# Altium schematic sheet ESP32-P1.SchDoc
size A4
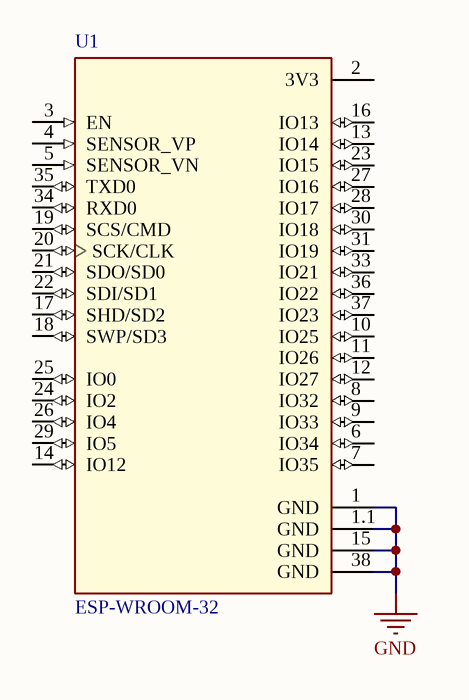
[diagram p0: ESP32-P1.SchDoc]

## Parts
U1  ESP-WROOM-32  [ESP-WROOM-32]

## Nets
GND: U1.1(GND) U1.1.1(GND) U1.15(GND) U1.38(GND)

Not connected (* = marked no-connect by the designer): U1 2(3V3) 3(EN) 4(SENSOR_VP) 5(SENSOR_VN) 6(IO34) 7(IO35) 8(IO32) 9(IO33) 10(IO25) 11(IO26) 12(IO27) 13(IO14) 14(IO12) 16(IO13) 17(SHD/SD2) 18(SWP/SD3) 19(SCS/CMD) 20(SCK/CLK) 21(SDO/SD0) 22(SDI/SD1) 23(IO15) 24(IO2) 25(IO0) 26(IO4) 27(IO16) 28(IO17) 29(IO5) 30(IO18) 31(IO19) 33(IO21) 34(RXD0) 35(TXD0) 36(IO22) 37(IO23)

## Library data of the parts
U1 = ESP-WROOM-32: Module: combo; GPIO, I2C x2, I2S x2, SDIO, SPI x3, UART x3; 19.5dBm; MF: Olimex LTD; SnapEDA_Link: https://www.snapeda.com/parts/ESP-WROOM-32/Olimex%20LTD/view-part/?ref=snap; MP: ESP-WROOM-32; Price: None; Package: Module Espressif Systems; Availability: Unavailable; Value: *